# EAGLE schematic Baseboard (EAGLE 6.5.0)
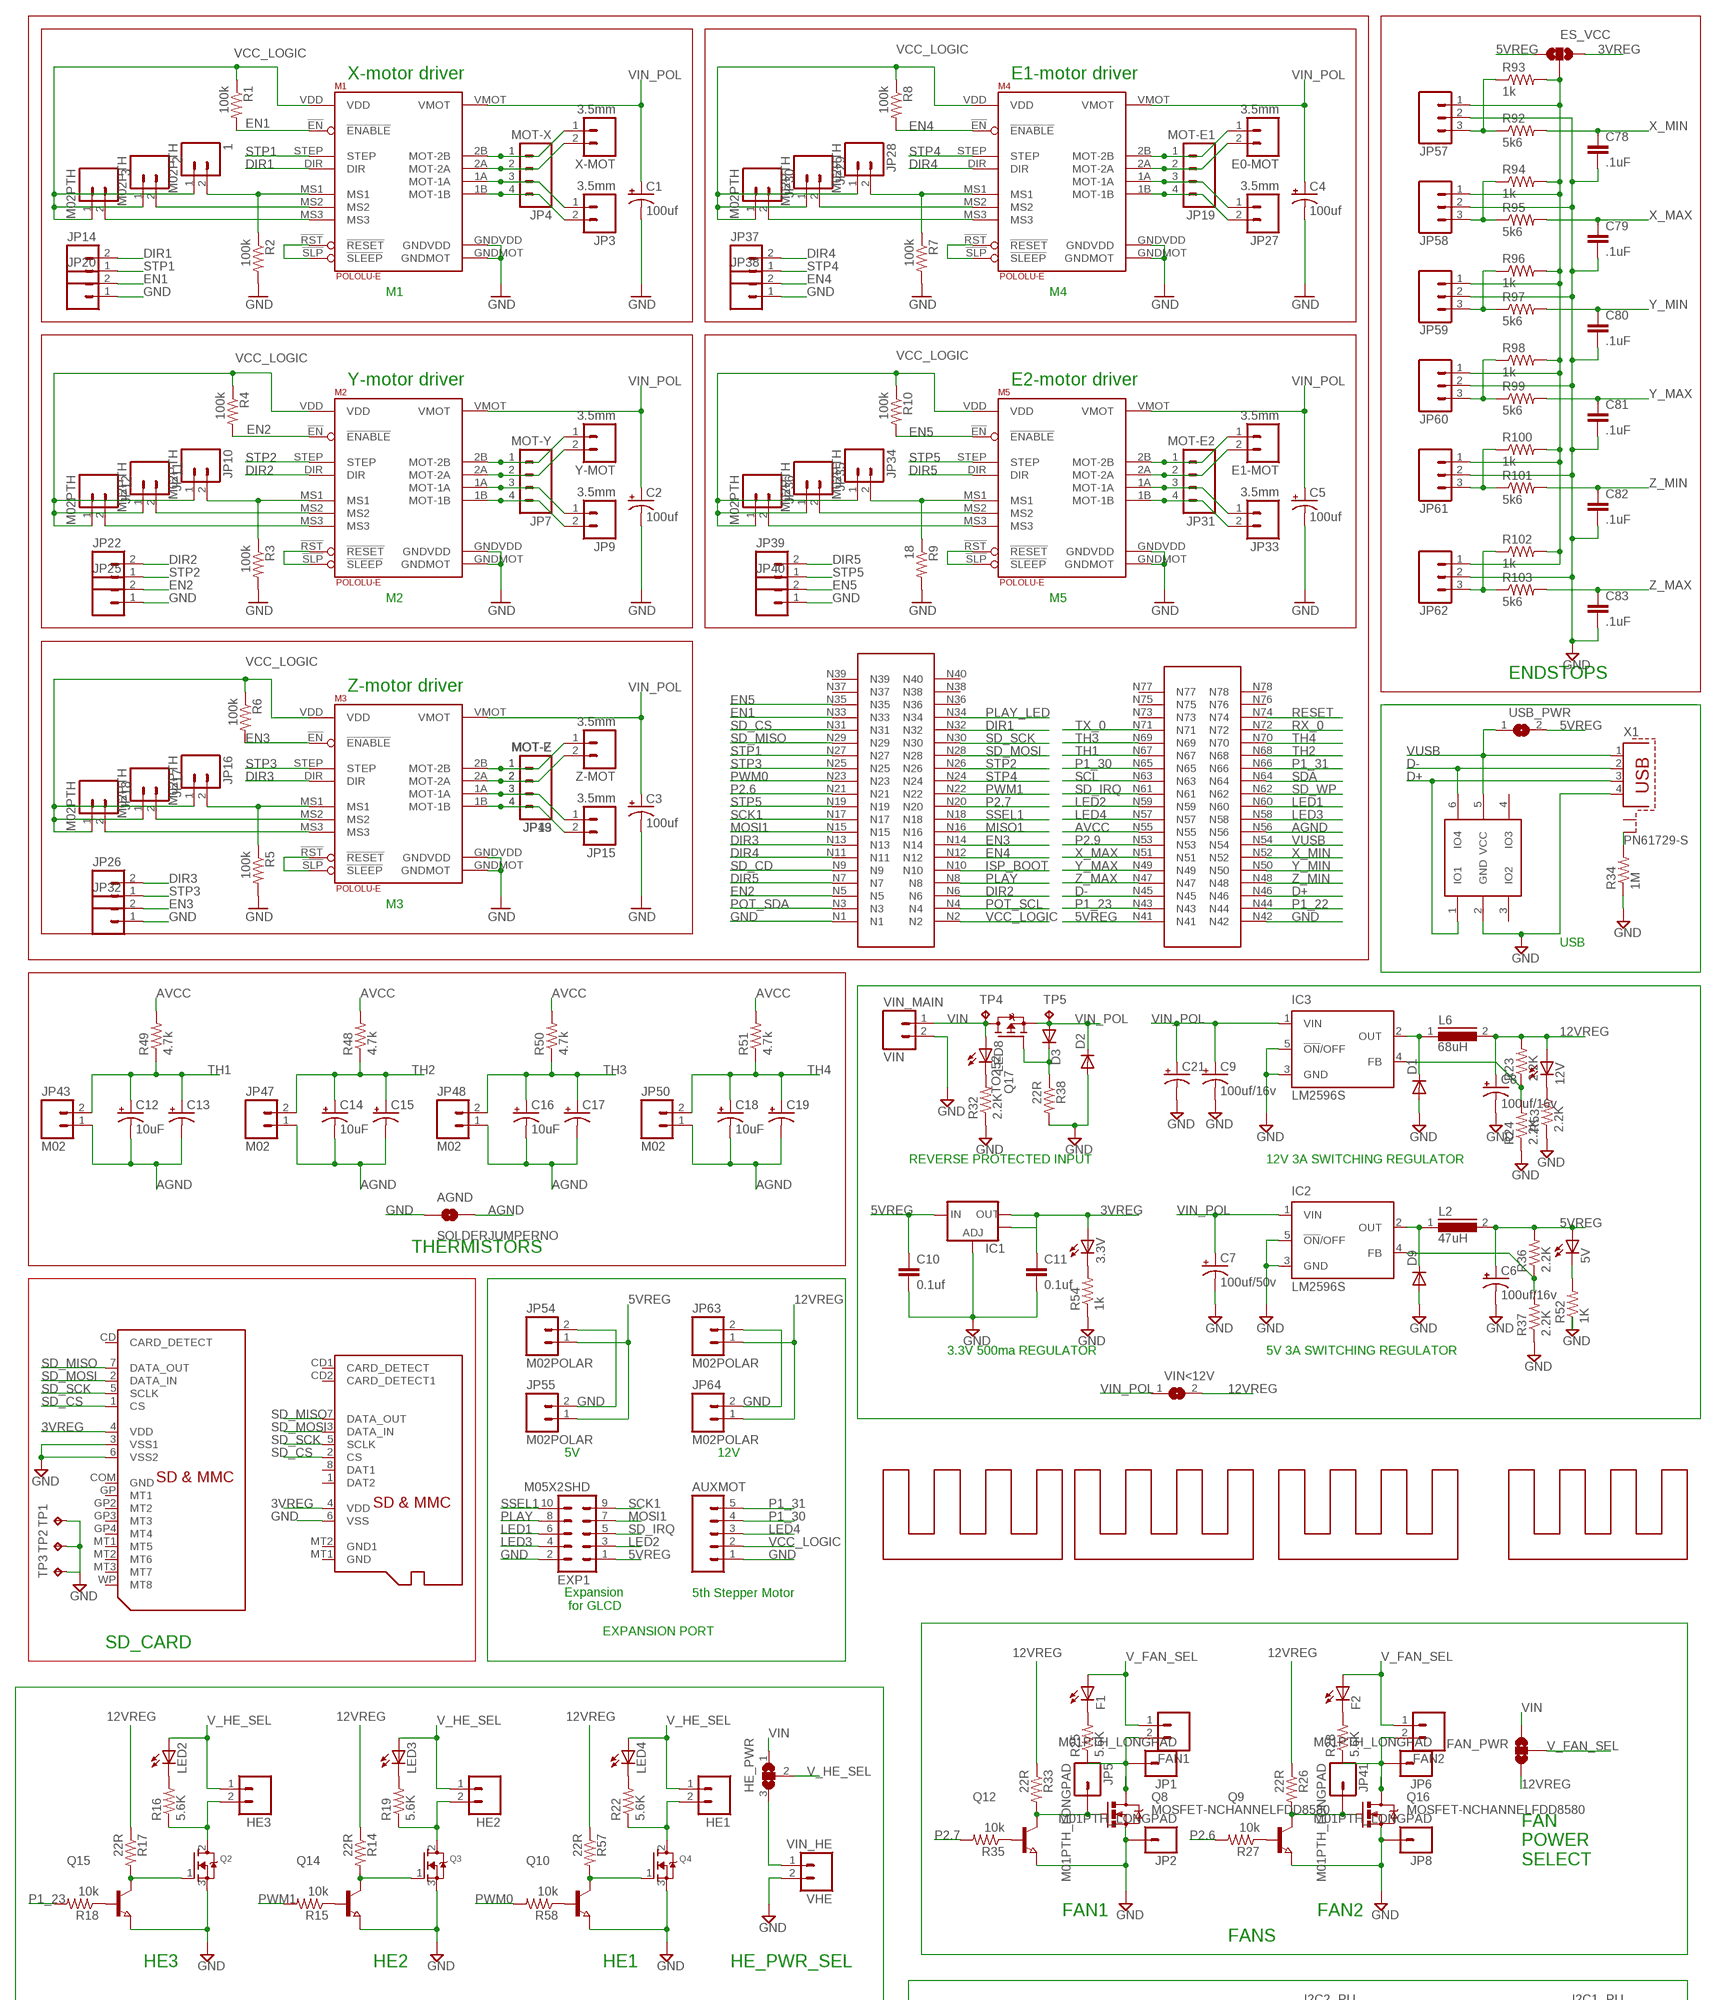
[diagram p0: schematic, sheet 1, part 1 of 2]
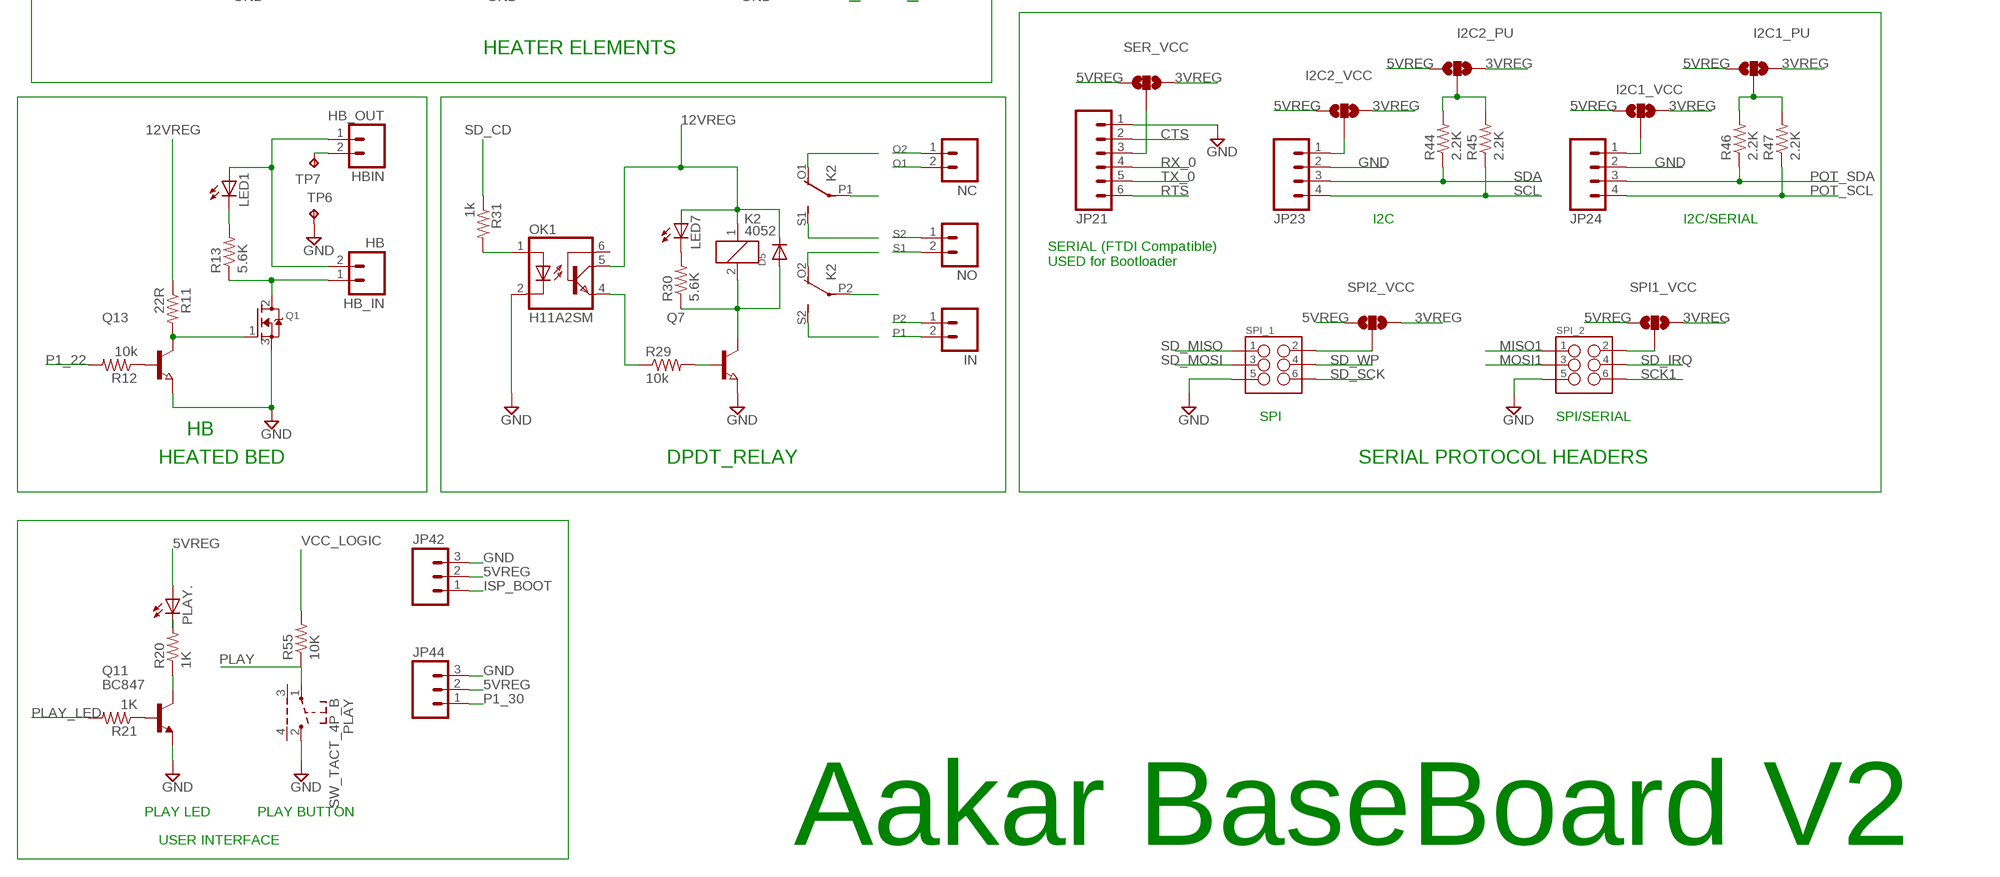
[diagram p1: schematic, sheet 1, part 2 of 2]

## Parts
1  M02PTH  [1X02]
2  M02PTH  [1X02]
3  M02PTH  [1X02]
3.3V  LEDCHIP-LED0603  [CHIP-LED0603]
5V  LEDCHIP-LED0603  [CHIP-LED0603]
12V  LEDCHIP-LED0603  [CHIP-LED0603]
AGND  SOLDERJUMPERNO  [SJ_2S-NO]
AUXMOT  M05PTH_LONGPADS  [1X05_LONGPADS]
C1  100uf  CAP_POLPTH1  [CPOL-RADIAL-100UF-25V]
C2  100uf  CAP_POLPTH1  [CPOL-RADIAL-100UF-25V]
C3  100uf  CAP_POLPTH1  [CPOL-RADIAL-100UF-25V]
C4  100uf  CAP_POLPTH1  [CPOL-RADIAL-100UF-25V]
C5  100uf  CAP_POLPTH1  [CPOL-RADIAL-100UF-25V]
C6  100uf/16v  CPOL-USE3.5-8  [E3,5-8]
C7  100uf/50v  CPOL-USE5-10.5  [E5-10,5]
C8  100uf/16v  CPOL-USE3.5-8  [E3,5-8]
C9  100uf/16v  CPOL-USE3.5-8  [E3,5-8]
C10  0.1uf  CAP0805  [0805]
C11  0.1uf  CAP0805  [0805]
C12  10uF  10UF-TANT  [EIA3216]
C13  CAP_POLPTH2  [CPOL-RADIAL-10UF-25V]
C14  10uF  10UF-TANT  [EIA3216]
C15  CAP_POLPTH2  [CPOL-RADIAL-10UF-25V]
C16  10uF  10UF-TANT  [EIA3216]
C17  CAP_POLPTH2  [CPOL-RADIAL-10UF-25V]
C18  10uF  10UF-TANT  [EIA3216]
C19  CAP_POLPTH2  [CPOL-RADIAL-10UF-25V]
C21  CPOL-USE2.5-7  [E2,5-7]
C78  .1uF  CAP0805  [0805]
C79  .1uF  CAP0805  [0805]
C80  .1uF  CAP0805  [0805]
C81  .1uF  CAP0805  [0805]
C82  .1uF  CAP0805  [0805]
C83  .1uF  CAP0805  [0805]
D1  DIODE-SMC  [SMC]
D2  DIODE-GF1  [GF1]
D3  DIODE-GF1  [GF1]
D5  DIODESMA  [SMADIODE]
D9  DIODE-SMC  [SMC]
E0-MOT  3.5mm  M023.5MM_LOCK  [SCREWTERMINAL-3.5MM-2_LOCK]
E1-MOT  3.5mm  M023.5MM_LOCK  [SCREWTERMINAL-3.5MM-2_LOCK]
ES_VCC  SOLDERJUMPER_2WAYS  [SJ_3]
EXP1  M05X2SHD  [2X5-SHROUDED]
F1  LEDCHIP-LED0603  [CHIP-LED0603]
F2  LEDCHIP-LED0603  [CHIP-LED0603]
FAN1  M025MM  [SCREWTERMINAL-5MM-2]
FAN2  M025MM  [SCREWTERMINAL-5MM-2]
FAN_PWR  SOLDERJUMPER_2WAYT  [SJ_2]
HB  HB_IN  M025MM  [SCREWTERMINAL-5MM-2]
HBIN  HB_OUT  M025MM  [SCREWTERMINAL-5MM-2]
HE1  M025MM  [SCREWTERMINAL-5MM-2]
HE2  M025MM  [SCREWTERMINAL-5MM-2]
HE3  M025MM  [SCREWTERMINAL-5MM-2]
HE_PWR  SJ2WW  [SJ_2W]
I2C1_PU  SOLDERJUMPER_2WAYPASTE1&2  [SJ_3_PASTE1&2]
I2C1_VCC  SOLDERJUMPER_2WAYPASTE1&2  [SJ_3_PASTE1&2]
I2C2_PU  SOLDERJUMPER_2WAYPASTE1&2  [SJ_3_PASTE1&2]
I2C2_VCC  SOLDERJUMPER_2WAYPASTE1&2  [SJ_3_PASTE1&2]
IC1  V_REG_LM1117SOT223  [SOT223]
IC2  LM2596S  [TO263-5]
IC3  LM2596S  [TO263-5]
IN  M025MM  [SCREWTERMINAL-5MM-2]
JP1  M01PTH_LONGPAD  [1X01_LONGPAD]
JP2  M01PTH_LONGPAD  [1X01_LONGPAD]
JP3  3.5mm  M023.5MM_LOCK  [SCREWTERMINAL-3.5MM-2_LOCK]
JP4  MOT-X  M04POLAR  [MOLEX-1X4]
JP5  M01PTH_LONGPAD  [1X01_LONGPAD]
JP6  M01PTH_LONGPAD  [1X01_LONGPAD]
JP7  MOT-Y  M04POLAR  [MOLEX-1X4]
JP8  M01PTH_LONGPAD  [1X01_LONGPAD]
JP9  3.5mm  M023.5MM_LOCK  [SCREWTERMINAL-3.5MM-2_LOCK]
JP10  M02PTH  [1X02]
JP11  M02PTH  [1X02]
JP12  M02PTH  [1X02]
JP13  MOT-E  M04POLAR  [MOLEX-1X4]
JP14  M02POGO_PIN_HOLES_ONLY  [1X02_PP_HOLES_ONLY]
JP15  3.5mm  M023.5MM_LOCK  [SCREWTERMINAL-3.5MM-2_LOCK]
JP16  M02PTH  [1X02]
JP17  M02PTH  [1X02]
JP18  M02PTH  [1X02]
JP19  MOT-E1  M04POLAR  [MOLEX-1X4]
JP20  M02POGO_PIN_HOLES_ONLY  [1X02_PP_HOLES_ONLY]
JP21  M06POLAR  [MOLEX-1X6]
JP22  M02POGO_PIN_HOLES_ONLY  [1X02_PP_HOLES_ONLY]
JP23  M04POLAR  [MOLEX-1X4]
JP24  M04POLAR  [MOLEX-1X4]
JP25  M02POGO_PIN_HOLES_ONLY  [1X02_PP_HOLES_ONLY]
JP26  M02POGO_PIN_HOLES_ONLY  [1X02_PP_HOLES_ONLY]
JP27  3.5mm  M023.5MM_LOCK  [SCREWTERMINAL-3.5MM-2_LOCK]
JP28  M02PTH  [1X02]
JP29  M02PTH  [1X02]
JP30  M02PTH  [1X02]
JP31  MOT-E2  M04POLAR  [MOLEX-1X4]
JP32  M02POGO_PIN_HOLES_ONLY  [1X02_PP_HOLES_ONLY]
JP33  3.5mm  M023.5MM_LOCK  [SCREWTERMINAL-3.5MM-2_LOCK]
JP34  M02PTH  [1X02]
JP35  M02PTH  [1X02]
JP36  M02PTH  [1X02]
JP37  M02POGO_PIN_HOLES_ONLY  [1X02_PP_HOLES_ONLY]
JP38  M02POGO_PIN_HOLES_ONLY  [1X02_PP_HOLES_ONLY]
JP39  M02POGO_PIN_HOLES_ONLY  [1X02_PP_HOLES_ONLY]
JP40  M02POGO_PIN_HOLES_ONLY  [1X02_PP_HOLES_ONLY]
JP41  M01PTH_LONGPAD  [1X01_LONGPAD]
JP42  M03POLAR  [MOLEX-1X3]
JP43  M02  M02POLAR_LOCK  [MOLEX-1X2_LOCK]
JP44  M03POLAR  [MOLEX-1X3]
JP47  M02  M02POLAR_LOCK  [MOLEX-1X2_LOCK]
JP48  M02  M02POLAR_LOCK  [MOLEX-1X2_LOCK]
JP49  MOT-Z  M04POLAR  [MOLEX-1X4]
JP50  M02  M02POLAR_LOCK  [MOLEX-1X2_LOCK]
JP54  M02POLAR  [MOLEX-1X2]
JP55  M02POLAR  [MOLEX-1X2]
JP57  M03POLAR  [MOLEX-1X3]
JP58  M03POLAR  [MOLEX-1X3]
JP59  M03POLAR  [MOLEX-1X3]
JP60  M03POLAR  [MOLEX-1X3]
JP61  M03POLAR  [MOLEX-1X3]
JP62  M03POLAR  [MOLEX-1X3]
JP63  M02POLAR  [MOLEX-1X2]
JP64  M02POLAR  [MOLEX-1X2]
K2  4052  [F4052]
L2  47uH  A26GFC  [A26GFC]
L6  68uH  A26GFC  [A26GFC]
LED1  LEDCHIP-LED0603  [CHIP-LED0603]
LED2  LEDCHIP-LED0603  [CHIP-LED0603]
LED3  LEDCHIP-LED0603  [CHIP-LED0603]
LED4  LEDCHIP-LED0603  [CHIP-LED0603]
LED7  LEDCHIP-LED0603  [CHIP-LED0603]
LED8  LEDCHIP-LED0603  [CHIP-LED0603]
M1  POLOLU-E  POLOLU-ALLEGRO  [POLOLU-ALLEGRO-PTH]
M2  POLOLU-E  POLOLU-ALLEGRO  [POLOLU-ALLEGRO-PTH]
M3  POLOLU-E  POLOLU-ALLEGRO  [POLOLU-ALLEGRO-PTH]
M4  POLOLU-E  POLOLU-ALLEGRO  [POLOLU-ALLEGRO-PTH]
M5  POLOLU-E  POLOLU-ALLEGRO  [POLOLU-ALLEGRO-PTH]
NC  M025MM  [SCREWTERMINAL-5MM-2]
NO  M025MM  [SCREWTERMINAL-5MM-2]
OK1  H11A2SM  [DIL6-SMD]
PLAY  SW_TACT_4P_B  [SW_TACT_STANDARD_RIGHT_ANGLE]
PLAY.  LED5MM  [LED5MM]
Q1  MOSFET-NGDS_TO220V  [TO220V]
Q2  MOSFET-NGDS_TO220V  [TO220V]
Q3  MOSFET-NGDS_TO220V  [TO220V]
Q4  MOSFET-NGDS_TO220V  [TO220V]
Q7  NPN-TRANSISTOR_SOT23  [SOT23]
Q8  MOSFET-NCHANNELFDD8580  [DPAK]
Q9  NPN-TRANSISTOR_SOT23  [SOT23]
Q10  NPN-TRANSISTOR_SOT23  [SOT23]
Q11  BC847  BC847ALT1SMD  [SOT23]
Q12  NPN-TRANSISTOR_SOT23  [SOT23]
Q13  NPN-TRANSISTOR_SOT23  [SOT23]
Q14  NPN-TRANSISTOR_SOT23  [SOT23]
Q15  NPN-TRANSISTOR_SOT23  [SOT23]
Q16  MOSFET-NCHANNELFDD8580  [DPAK]
Q17  TO252  SPD30P06PTO252  [TO252]
R1  100k  RESISTOR0603-RES  [0603-RES]
R2  100k  RESISTOR0603-RES  [0603-RES]
R3  100k  RESISTOR0603-RES  [0603-RES]
R4  100k  RESISTOR0603-RES  [0603-RES]
R5  100k  RESISTOR0603-RES  [0603-RES]
R6  100k  RESISTOR0603-RES  [0603-RES]
R7  100k  RESISTOR0603-RES  [0603-RES]
R8  100k  RESISTOR0603-RES  [0603-RES]
R9  18  RESISTOR0603-RES  [0603-RES]
R10  100k  RESISTOR0603-RES  [0603-RES]
R11  22R  RESISTOR0603-RES  [0603-RES]
R12  10k  RESISTOR0603-RES  [0603-RES]
R13  5.6K  RESISTOR0603-RES  [0603-RES]
R14  22R  RESISTOR0603-RES  [0603-RES]
R15  10k  RESISTOR0603-RES  [0603-RES]
R16  5.6K  RESISTOR0603-RES  [0603-RES]
R17  22R  RESISTOR0603-RES  [0603-RES]
R18  10k  RESISTOR0603-RES  [0603-RES]
R19  5.6K  RESISTOR0603-RES  [0603-RES]
R20  1K  RESISTOR0603-RES  [0603-RES]
R21  1K  1KOHM1/10W1%(0603)  [0603-RES]
R22  5.6K  RESISTOR0603-RES  [0603-RES]
R23  2.2K  RESISTOR0603-RES  [0603-RES]
R24  2.2K  RESISTOR0603-RES  [0603-RES]
R25  5.6K  RESISTOR0603-RES  [0603-RES]
R26  22R  RESISTOR0603-RES  [0603-RES]
R27  10k  RESISTOR0603-RES  [0603-RES]
R28  5.6K  RESISTOR0603-RES  [0603-RES]
R29  10k  RESISTOR0603-RES  [0603-RES]
R30  5.6K  RESISTOR0603-RES  [0603-RES]
R31  1k  RESISTOR0603-RES  [0603-RES]
R32  2.2K  RESISTOR0603-RES  [0603-RES]
R33  22R  RESISTOR0603-RES  [0603-RES]
R34  1M  RESISTOR0805-RES  [0805]
R35  10k  RESISTOR0603-RES  [0603-RES]
R36  2.2K  RESISTOR0603-RES  [0603-RES]
R37  2.2K  RESISTOR0603-RES  [0603-RES]
R38  22R  RESISTOR0603-RES  [0603-RES]
R44  2.2K  RESISTOR0603-RES  [0603-RES]
R45  2.2K  RESISTOR0603-RES  [0603-RES]
R46  2.2K  RESISTOR0603-RES  [0603-RES]
R47  2.2K  RESISTOR0603-RES  [0603-RES]
R48  4.7k  RESISTOR0603-RES  [0603-RES]
R49  4.7k  RESISTOR0603-RES  [0603-RES]
R50  4.7k  RESISTOR0603-RES  [0603-RES]
R51  4.7k  RESISTOR0603-RES  [0603-RES]
R52  1K  RESISTOR0603-RES  [0603-RES]
R53  2.2K  RESISTOR0603-RES  [0603-RES]
R54  1k  RESISTOR0603-RES  [0603-RES]
R55  10K  RESISTOR0603-RES  [0603-RES]
R57  22R  RESISTOR0603-RES  [0603-RES]
R58  10k  RESISTOR0603-RES  [0603-RES]
R92  5k6  RESISTOR0603-RES  [0603-RES]
R93  1k  RESISTOR0603-RES  [0603-RES]
R94  1k  RESISTOR0603-RES  [0603-RES]
R95  5k6  RESISTOR0603-RES  [0603-RES]
R96  1k  RESISTOR0603-RES  [0603-RES]
R97  5k6  RESISTOR0603-RES  [0603-RES]
R98  1k  RESISTOR0603-RES  [0603-RES]
R99  5k6  RESISTOR0603-RES  [0603-RES]
R100  1k  RESISTOR0603-RES  [0603-RES]
R101  5k6  RESISTOR0603-RES  [0603-RES]
R102  1k  RESISTOR0603-RES  [0603-RES]
R103  5k6  RESISTOR0603-RES  [0603-RES]
SER_VCC  SOLDERJUMPER_2WAYPASTE1&2  [SJ_3_PASTE1&2]
SPI1_VCC  SOLDERJUMPER_2WAYPASTE1&2  [SJ_3_PASTE1&2]
SPI2_VCC  SOLDERJUMPER_2WAYPASTE1&2  [SJ_3_PASTE1&2]
SPI_1  M03X2NO_SILK  [2X3-NS]
SPI_2  M03X2NO_SILK  [2X3-NS]
TP1  TPTP15SQ  [TP15SQ]
TP2  TPTP15SQ  [TP15SQ]
TP3  TPTP15SQ  [TP15SQ]
TP4  TPPAD1-13  [P1-13]
TP5  TPPAD1-13  [P1-13]
TP6  TPPAD1-17Y  [P1-17Y]
TP7  TPPAD1-17Y  [P1-17Y]
U$1  HEATSINK  [HEAT_TO]
U$2  MICROSD  [MICROSD]
U$4  CPU_HEADER  [CPU_BOARD]
U$8  HEATSINK  [HEAT_TO]
U$9  ESD  ESD_TPD4E001  [SOT23-6]
U$10  HEATSINK  [HEAT_TO]
U$11  SD_MMC  [SD_MMC]
U$12  HEATSINK  [HEAT_TO]
USB_PWR  SJ  [SJ]
VHE  VIN_HE  M025MM  [SCREWTERMINAL-5MM-2]
VIN  VIN_MAIN  M025MM  [SCREWTERMINAL-5MM-2]
VIN<12V  SJ  [SJ]
X1  PN61729-S  [PN61729-S]
X-MOT  3.5mm  M023.5MM_LOCK  [SCREWTERMINAL-3.5MM-2_LOCK]
Y-MOT  3.5mm  M023.5MM_LOCK  [SCREWTERMINAL-3.5MM-2_LOCK]
Z-MOT  3.5mm  M023.5MM_LOCK  [SCREWTERMINAL-3.5MM-2_LOCK]

## Nets
3VREG: 3.3V.A C11.1 ES_VCC.3 I2C1_PU.3 I2C1_VCC.3 I2C2_PU.3 I2C2_VCC.3 IC1.2(OUT) IC1.4(OUT) SER_VCC.3 SPI1_VCC.3 SPI2_VCC.3 U$2.4(VDD) U$11.4(VDD)
5VREG: 5V.A C6.+ C10.1 ES_VCC.1 EXP1.1 I2C1_PU.1 I2C1_VCC.1 I2C2_PU.1 I2C2_VCC.1 IC1.3(IN) JP42.2 JP44.2 JP54.1 JP55.1 L2.2 PLAY..A R36.2 SER_VCC.1 SPI1_VCC.1 SPI2_VCC.1 U$4.N41 USB_PWR.2
12VREG: 12V.A C8.+ D5.C FAN_PWR.3 JP63.1 JP64.1 K2.1 L6.2 LED7.A OK1.5(COL) R11.1 R14.1 R17.1 R23.2 R26.1 R33.1 R57.1 VIN<12V.2
AGND: AGND.2 C12.C(-) C13.2(-) C14.C(-) C15.2(-) C16.C(-) C17.2(-) C18.C(-) C19.2(-) JP43.1 JP47.1 JP48.1 JP50.1 U$4.N56
AVCC: R48.2 R49.2 R50.2 R51.2 U$4.N55
CTS: JP21.2
D+: U$4.N46 U$9.1(IO1) X1.3
D-: U$4.N45 U$9.6(IO4) X1.2
DIR1: JP14.2 M1.DIR U$4.N32
DIR2: JP22.2 M2.DIR U$4.N6
DIR3: JP26.2 M3.DIR U$4.N13
DIR4: JP37.2 M4.DIR U$4.N11
DIR5: JP39.2 M5.DIR U$4.N7
E-MOT-1A [power]: JP3.1 JP4.3 M1.1A(MOT-1A)
E-MOT-1A1 [power]: JP7.3 JP9.1 M2.1A(MOT-1A)
E-MOT-1A2 [power]: JP13.3 JP15.1 JP49.3 M3.1A(MOT-1A)
E-MOT-1A3 [power]: JP19.3 JP27.1 M4.1A(MOT-1A)
E-MOT-1A4 [power]: JP31.3 JP33.1 M5.1A(MOT-1A)
E-MOT-1B [power]: JP3.2 JP4.4 M1.1B(MOT-1B)
E-MOT-1B1 [power]: JP7.4 JP9.2 M2.1B(MOT-1B)
E-MOT-1B2 [power]: JP13.4 JP15.2 JP49.4 M3.1B(MOT-1B)
E-MOT-1B3 [power]: JP19.4 JP27.2 M4.1B(MOT-1B)
E-MOT-1B4 [power]: JP31.4 JP33.2 M5.1B(MOT-1B)
E-MOT-2A [power]: JP4.2 M1.2A(MOT-2A) X-MOT.2
E-MOT-2A1 [power]: JP7.2 M2.2A(MOT-2A) Y-MOT.2
E-MOT-2A2 [power]: JP13.2 JP49.2 M3.2A(MOT-2A) Z-MOT.2
E-MOT-2A3 [power]: E0-MOT.2 JP19.2 M4.2A(MOT-2A)
E-MOT-2A4 [power]: E1-MOT.2 JP31.2 M5.2A(MOT-2A)
E-MOT-2B [power]: JP4.1 M1.2B(MOT-2B) X-MOT.1
E-MOT-2B1 [power]: JP7.1 M2.2B(MOT-2B) Y-MOT.1
E-MOT-2B2 [power]: JP13.1 JP49.1 M3.2B(MOT-2B) Z-MOT.1
E-MOT-2B3 [power]: E0-MOT.1 JP19.1 M4.2B(MOT-2B)
E-MOT-2B4 [power]: E1-MOT.1 JP31.1 M5.2B(MOT-2B)
E-RESETSLEEP: M1.!RST(!RESET) M1.!SLP(!SLEEP)
E-RESETSLEEP1: M2.!RST(!RESET) M2.!SLP(!SLEEP)
E-RESETSLEEP2: M3.!RST(!RESET) M3.!SLP(!SLEEP)
E-RESETSLEEP3: M4.!RST(!RESET) M4.!SLP(!SLEEP)
E-RESETSLEEP4: M5.!RST(!RESET) M5.!SLP(!SLEEP)
EN1: JP20.2 M1.!EN(!ENABLE) R1.2 U$4.N33
EN2: JP25.2 M2.!EN(!ENABLE) R4.2 U$4.N5
EN3: JP32.2 M3.!EN(!ENABLE) R6.2 U$4.N14
EN4: JP38.2 M4.!EN(!ENABLE) R8.2 U$4.N12
EN5: JP40.2 M5.!EN(!ENABLE) R10.2 U$4.N35
GND [power]: AGND.1 AUXMOT.1 C1.2(-) C2.2(-) C3.2(-) C4.2(-) C5.2(-) C6.- C7.- C8.- C9.- C10.2 C11.2 C21.- C78.2 C79.2 C80.2 C81.2 C82.2 C83.2 D1.A D2.A D9.A EXP1.2 IC1.1(ADJ) IC2.3(GND) IC2.5(!ON!/OFF) IC3.3(GND) IC3.5(!ON!/OFF) JP2.1 JP8.1 JP20.1 JP21.1 JP23.2 JP24.2 JP25.1 JP32.1 JP38.1 JP40.1 JP42.3 JP44.3 JP54.2 JP55.2 JP57.2 JP58.2 JP59.2 JP60.2 JP61.2 JP62.2 JP63.2 JP64.2 M1.GNDMOT M1.GNDVDD M2.GNDMOT M2.GNDVDD M3.GNDMOT M3.GNDVDD M4.GNDMOT M4.GNDVDD M5.GNDMOT M5.GNDVDD OK1.2(C) PLAY.2 Q1.3(S) Q2.3(S) Q3.3(S) Q4.3(S) Q7.2(E) Q8.3(S) Q9.2(E) Q10.2(E) Q11.2(E) Q12.2(E) Q13.2(E) Q14.2(E) Q15.2(E) Q16.3(S) R2.2 R3.2 R5.2 R7.2 R9.2 R24.1 R32.1 R34.1 R37.1 R38.2 R52.1 R53.1 R54.1 SPI_1.5 SPI_2.5 TP1.TP TP2.TP TP3.TP TP6.TP U$2.6(VSS) U$4.N1 U$4.N42 U$9.2(GND) U$11.3(VSS1) U$11.6(VSS2) VHE.2 VIN.2 X1.4
ISP_BOOT: JP42.1 U$4.N10
LED1: EXP1.6 U$4.N60
LED2: EXP1.3 U$4.N59
LED3: EXP1.4 U$4.N58
LED4: AUXMOT.3 U$4.N57
MISO1: SPI_2.1 U$4.N16
MOSI1: EXP1.7 SPI_2.3 U$4.N15
N$1: JP11.2 M2.MS2
N$2: JP10.2 M2.MS1 R3.1
N$3: JP12.2 M2.MS3
N$4: JP17.2 M3.MS2
N$5: JP16.2 M3.MS1 R5.1
N$6: JP18.2 M3.MS3
N$7: JP29.2 M4.MS2
N$8: JP28.2 M4.MS1 R7.1
N$9: JP30.2 M4.MS3
N$10: JP35.2 M5.MS2
N$11: JP34.2 M5.MS1 R9.1
N$12: JP36.2 M5.MS3
N$13: D1.C IC3.2(OUT) L6.1
N$14: D9.C IC2.2(OUT) L2.1
N$15: HB.1 Q1.2(D) R13.1
N$16: HBIN.2 TP7.TP
N$17: HB.2 HBIN.1 LED1.A
N$18: Q1.1(G) Q13.3(C) R11.2
N$20: LED1.C R13.2
N$21: 2.2 M1.MS2
N$22: 1.2 M1.MS1 R2.1
N$23: 3.2 M1.MS3
N$24: SPI1_VCC.2 SPI_2.2
N$25: LED2.C R16.2
N$26: SPI2_VCC.2 SPI_1.2
N$27: Q3.1(G) Q14.3(C) R14.2
N$28: HE3.2 Q2.2(D) R16.1
N$29: F1.C R25.2
N$30: LED3.C R19.2
N$31: Q14.1(B) R15.1
N$32: HE2.2 Q3.2(D) R19.1
N$33: Q13.1(B) R12.1
N$34: LED4.C R22.2
N$35: Q11.1(B) R21.1
N$36: HE1.2 Q4.2(D) R22.1
N$37: 5V.C R52.2
N$38: Q2.1(G) Q15.3(C) R17.2
N$40: FAN1.2 JP1.1 Q8.4(D) R25.1
N$41: 12V.C R53.2
N$42: F2.C R28.2
N$43: JP41.1 Q9.3(C) Q16.1(G) R26.2
N$44: FAN2.2 JP6.1 Q16.4(D) R28.1
N$45: 3.3V.C R54.2
N$48: OK1.1(A) R31.2
N$49: OK1.4(EMI) R29.1
N$50: Q7.1(B) R29.2
N$51: Q15.1(B) R18.1
N$52: LED7.C R30.2
N$53: D5.A K2.2 Q7.3(C) R30.1
N$57: LED8.C R32.2
N$58: JP5.1 Q8.1(G) Q12.3(C) R33.2
N$60: IC2.4(FB) R36.1 R37.2
N$61: JP21.3 SER_VCC.2
N$63: R34.2 X1.S2
N$68: PLAY..K(C) R20.2
N$69: Q12.1(B) R35.1
N$71: I2C2_VCC.2 JP23.1
N$72: I2C2_PU.2 R44.2 R45.2
N$73: I2C1_VCC.2 JP24.1
N$74: I2C1_PU.2 R46.2 R47.2
N$84: D3.C Q17.1(G) R38.1
N$91: JP61.3 R100.1 R101.1
N$92: JP59.3 R96.1 R97.1
N$93: JP62.3 R102.1 R103.1
N$97: Q9.1(B) R27.1
N$98: Q4.1(G) Q10.3(C) R57.2
N$99: Q10.1(B) R58.1
N$100: IC3.4(FB) R23.1 R24.2
N$114: JP58.3 R94.1 R95.1
N$115: ES_VCC.2 JP57.1 JP58.1 JP59.1 JP60.1 JP61.1 JP62.1 R93.2 R94.2 R96.2 R98.2 R100.2 R102.2
N$117: JP60.3 R98.1 R99.1
N$122: JP57.3 R92.1 R93.1
O1: K2.O1(2:O) NC.2
O2: K2.O2(3:O) NC.1
P1: IN.2 K2.P1(2:P)
P1_22: R12.2 U$4.N44
P1_23: R18.2 U$4.N43
P1_30: AUXMOT.4 JP44.1 U$4.N65
P1_31: AUXMOT.5 U$4.N66
P2: IN.1 K2.P2(3:P)
P2.6: R27.2 U$4.N21
P2.7: R35.2 U$4.N20
P2.9: U$4.N53
PL#: Q11.3(C) R20.1
PLAY: EXP1.8 PLAY.1 R55.1 U$4.N8
PLAY_LED: R21.2 U$4.N34
POT_SCL: JP24.4 R47.1 U$4.N4
POT_SDA: JP24.3 R46.1 U$4.N3
PWM0: R58.2 U$4.N23
PWM1: R15.2 U$4.N22
RESET: U$4.N74
RTS: JP21.6
RX_0: JP21.4 U$4.N72
S1: K2.S1(2:S) NO.2
S2: K2.S2(3:S) NO.1
SCK1: EXP1.9 SPI_2.6 U$4.N17
SCL: JP23.4 R45.1 U$4.N63
SD_CD: R31.1 U$4.N9
SD_CS: U$2.2(CS) U$4.N31 U$11.1(CS)
SD_IRQ: EXP1.5 SPI_2.4 U$4.N61
SD_MISO: SPI_1.1 U$2.7(DATA_OUT) U$4.N29 U$11.7(DATA_OUT)
SD_MOSI: SPI_1.3 U$2.3(DATA_IN) U$4.N28 U$11.2(DATA_IN)
SD_SCK: SPI_1.6 U$2.5(SCLK) U$4.N30 U$11.5(SCLK)
SD_WP: SPI_1.4 U$4.N62
SDA: JP23.3 R44.1 U$4.N64
SSEL1: EXP1.10 U$4.N18
STP1: JP14.1 M1.STEP U$4.N27
STP2: JP22.1 M2.STEP U$4.N26
STP3: JP26.1 M3.STEP U$4.N25
STP4: JP37.1 M4.STEP U$4.N24
STP5: JP39.1 M5.STEP U$4.N19
TH1: C12.A(+) C13.1(+) JP43.2 R49.1 U$4.N67
TH2: C14.A(+) C15.1(+) JP47.2 R48.1 U$4.N68
TH3: C16.A(+) C17.1(+) JP48.2 R50.1 U$4.N69
TH4: C18.A(+) C19.1(+) JP50.2 R51.1 U$4.N70
TX_0: JP21.5 U$4.N71
V_FAN_SEL: F1.A F2.A FAN1.1 FAN2.1 FAN_PWR.2
V_HE_SEL: HE1.1 HE2.1 HE3.1 HE_PWR.2 LED2.A LED3.A LED4.A
VCC_LOGIC: 1.1 2.1 3.1 AUXMOT.2 JP10.1 JP11.1 JP12.1 JP16.1 JP17.1 JP18.1 JP28.1 JP29.1 JP30.1 JP34.1 JP35.1 JP36.1 M1.VDD M2.VDD M3.VDD M4.VDD M5.VDD R1.1 R4.1 R6.1 R8.1 R10.1 R55.2 U$4.N2
VIN: FAN_PWR.1 HE_PWR.1 LED8.A Q17.3(D) TP4.TP VIN.1
VIN_HE: HE_PWR.3 VHE.1
VIN_POL: C1.1(+) C2.1(+) C3.1(+) C4.1(+) C5.1(+) C7.+ C9.+ C21.+ D2.C D3.A IC2.1(VIN) IC3.1(VIN) M1.VMOT M2.VMOT M3.VMOT M4.VMOT M5.VMOT Q17.2(S) TP5.TP VIN<12V.1
VUSB: U$4.N54 U$9.5(VCC) USB_PWR.1 X1.1
X_MAX: C79.1 R95.2 U$4.N51
X_MIN: C78.1 R92.2 U$4.N52
Y_MAX: C81.1 R99.2 U$4.N49
Y_MIN: C80.1 R97.2 U$4.N50
Z_MAX: C83.1 R103.2 U$4.N47
Z_MIN: C82.1 R101.2 U$4.N48
Unconnected: OK1.6(BAS) PLAY.3 PLAY.4 U$2.1(DAT2) U$2.8(DAT1) U$2.CD1(CARD_DETECT) U$2.CD2(CARD_DETECT1) U$2.MT1(GND) U$2.MT2(GND1) U$4.N36 U$4.N37 U$4.N38 U$4.N39 U$4.N40 U$4.N73 U$4.N75 U$4.N76 U$4.N77 U$4.N78 U$9.3(IO2) U$9.4(IO3) U$11.CD(CARD_DETECT) U$11.COM(GND) U$11.GP2(MT2) U$11.GP3(MT3) U$11.GP4(MT4) U$11.GP(MT1) U$11.MT1(MT5) U$11.MT2(MT6) U$11.MT3(MT7) U$11.WP(MT8) X1.S1

## Notes on the sheet
- X-motor driver | E1-motor driver
- M1 | M4
- Y-motor driver | E2-motor driver
- M2 | M5
- ENDSTOPS
- Z-motor driver
- M3
- USB
- REVERSE PROTECTED INPUT | 12V 3A SWITCHING REGULATOR
- THERMISTORS
- 3.3V 500ma REGULATOR | 5V 3A SWITCHING REGULATOR
- 5V | 12V
- 5th Stepper Motor
- Expansion
   for GLCD
- EXPANSION PORT
- SD_CARD
- FAN
  POWER
  SELECT
- FAN1 | FAN2
- FANS
- HE3 | HE2 | HE1 | HE_PWR_SEL
- HEATER ELEMENTS
- I2C | I2C/SERIAL
- SERIAL (FTDI Compatible)
  USED for Bootloader
- SPI | SPI/SERIAL
- HB
- HEATED BED | DPDT_RELAY | SERIAL PROTOCOL HEADERS
- PLAY LED | PLAY BUTTON
- USER INTERFACE | Aakar BaseBoard V2

## Library data of the parts
1-3 E0-MOT E1-MOT HB HBIN JP3 JP9-JP12 JP15-JP18 JP27-JP30 JP33-JP36 JP43 JP47 JP48 JP50 JP54 JP55 JP63 JP64 X-MOT Y-MOT Z-MOT = SparkFun-Connectors:M02: Standard 2-pin 0.1" header. Use with - straight break away headers ( PRT-00116) - right angle break away headers (PRT-00553) - swiss pins (PRT-00743) - machine pins (PRT-00117) - female headers (PRT-00115) Molex polarized connector foot print use with: PRT-08233 with associated crimp pins and housings. 2.54_SCREWTERM for use with PRT-10571. 3.5mm Screw Terminal footprints for PRT-08084 5mm Screw Terminal footprints for use with PRT-08433
3.3V 5V 12V F1 F2 LED1-LED4 LED7 LED8 = adafruit:LED: LED OSRAM: - CHIPLED LG R971, LG N971, LY N971, LG Q971, LY Q971, LO R971, LY R971 LH N974, LH R974 LS Q976, LO Q976, LY Q976 LO Q996 - Hyper CHIPLED LW Q18S LB Q993, LB Q99A, LB R99A - SideLED LS A670, LO A670, LY A670, LG A670, LP A670 LB A673, LV A673, LT A673, LW A673 LH A674 LY A675 LS A676, LA A676, LO A676, LY A676, LW A676 LS A679, LY A679, LG A679 - Hyper Micro SIDELED® LS Y876, LA Y876, LO Y876, LY Y876 LT Y87S - SmartLED LW L88C, LW L88S LB L89C, LB L89S, LG L890 LS L89K, LO L89K, LY L89K LS L896, LA L896, LO L896, LY L896 - TOPLED LS T670, LO T670, LY T670, LG T670, LP T670 LSG T670, LSP T670, LSY T670, LOP T670, LYG T670 LG T671, LOG T671, LSG T671 LB T673, LV T673, LT T673, LW T673 LH T674 LS T676, LA T676, LO T676, LY T676, LB T676, LH T676, LSB T676, LW T676 LB T67C, LV T67C, LT T67C, LS T67K, LO T67K, LY T67K, LW E67C LS E67B, LA E67B, LO E67B, LY E67B, LB E67C, LV E67C, LT E67C LW T67C LS T679, LY T679, LG T679 LS T770, LO T770, LY T770, LG T770, LP T770 LB T773, LV T773, LT T773, LW T773 LH T774 LS E675, LA E675, LY E675, LS T675 LS T776, LA T776, LO T776, LY T776, LB T776 LHGB T686 LT T68C, LB T68C - Hyper Mini TOPLED® LB M676 - Mini TOPLED Santana® LG M470 LS M47K, LO M47K, LY M47K Source: http://www.osram.convergy.de/
AGND = SparkFun-Passives:SOLDERJUMPER: Solder Jumper Standard SMD solder jumper. Used to automate production. Two varients : Normally Open and Normally Closed are the same, but have different paste layers. NC will have a large amount of paste and should jumper during reflow.
AUXMOT = SparkFun-Connectors:M05: Header 5 Standard 5-pin 0.1" header. Use with straight break away headers (SKU : PRT-00116), right angle break away headers (PRT-00553), swiss pins (PRT-00743), machine pins (PRT-00117), and female headers (PRT-00115). Molex polarized connector foot print use with SKU : PRT-08230 with associated crimp pins and housings.
C1-C5 = SparkFun:CAP_POL: Capacitor Polarized These are standard SMD and PTH capacitors. Normally 10uF, 47uF, and 100uF in electrolytic and tantalum varieties. Always verify the external diameter of the through hole cap, it varies with capacity, voltage, and manufacturer. The EIA devices should be standard.
C6-C9 C21 = adafruit:CPOL-US: POLARIZED CAPACITOR, American symbol
C10 C11 = SparkFun-Passives:CAP: Capacitor Standard 0603 ceramic capacitor, and 0.1" leaded capacitor.
C12 C14 C16 C18 = SparkFun-Capacitors:10UF-TANT: 10uF Tantalum SMT CAP-00811- 16V 10% (EIA-3216); PROD_ID: CAP-00811
C13 C15 C17 C19 = SparkFun-Passives:CAP_POL: Capacitor Polarized These are standard SMD and PTH capacitors. Normally 10uF, 47uF, and 100uF in electrolytic and tantalum varieties. Always verify the external diameter of the through hole cap, it varies with capacity, voltage, and manufacturer. The EIA devices should be standard.
C78-C83 = SparkFun-Capacitors:CAP: Capacitor Standard 0603 ceramic capacitor, and 0.1" leaded capacitor.
D1-D3 D9 = diode:DIODE-: DIODE
D5 = adafruit:DIODE: Diode SMADIODE - SMA Surface Mount Package 20V 1A Schottky Diode Digikey: 641-1014-6-ND DO-1N4148 - Through Hole Small Current Diode SOD-123 20V 1 A (.5mV Vf) Schottky Diode - Digikey: MBRX120TPMSCT-ND SOD-323 10V 570mA (.38mV Vf, 3ns) Schottky Diode - Digikey: ZLLS410CT-ND SOD-523 30V 30mA Schottky Diode (RB751S-40TE61) - Digikey: RB751S-40TE61CT-ND SOT23-R/W - SOT23 Package (R = Solder Paste/Reflow Ovens, W = Hand-Soldering) BAT54Film 40V 300mA - Digikey: 497-7162-1-ND
ES_VCC FAN_PWR = SparkFun:SOLDERJUMPER_2WAY: Solder Jumper 2 way solder jumper
EXP1 = SparkFun:M05X2: Header 5x2 Standard 10-pin dual row 0.1" header. Commonly used with AVR-ISP. Use with Spark Fun Electronics SKU: PRT-00778
FAN1 FAN2 HE1-HE3 IN JP14 JP20 JP22 JP25 JP26 JP32 JP37-JP40 NC NO VHE VIN = SparkFun:M02: Header 2 Standard 2-pin 0.1" header. Use with straight break away headers (SKU : PRT-00116), right angle break away headers (PRT-00553), swiss pins (PRT-00743), machine pins (PRT-00117), and female headers (PRT-00115). Molex polarized connector foot print use with SKU : PRT-08233 with associated crimp pins and housings.
HE_PWR = jumper:SJ2W: SMD solder JUMPER
I2C1_PU I2C1_VCC I2C2_PU I2C2_VCC SER_VCC SPI1_VCC SPI2_VCC = SparkFun-Passives:SOLDERJUMPER_2WAY: Solder Jumper 2 way solder jumper
IC1 = SparkFun-PowerIC:V_REG_LM1117: Voltage Regulator LM1117 Standard adjustable voltage regulator but in SMD form. Spark Fun Electronics SKU : COM-00595
IC2 IC3 = national-semiconductor:LM2596: SIMPLE SWITCHER® Power Converter 150 kHz 3A Step-Down Voltage Regulator Source: http://www.national.com/ds/LM/LM2596.pdf; MF: NATIONAL SEMICONDUCTOR; MPN: LM2596S-ADJ/NOPB; OC_FARNELL: 9494367; OC_NEWARK: 41K3842
JP1 JP2 JP5 JP6 JP8 JP41 = SparkFun:M01: Header 1 Standard 1-pin 0.1" header. Use with straight break away headers (SKU : PRT-00116), right angle break away headers (PRT-00553), swiss pins (PRT-00743), machine pins (PRT-00117), and female headers (PRT-00115).
JP4 JP7 JP13 JP19 JP31 JP49 = SparkFun:M04: Header 4 Standard 4-pin 0.1" header. Use with straight break away headers (SKU : PRT-00116), right angle break away headers (PRT-00553), swiss pins (PRT-00743), machine pins (PRT-00117), and female headers (PRT-00115). Molex polarized connector foot print use with SKU : PRT-08231 with associated crimp pins and housings. 1MM SMD Version SKU: PRT-10208
JP21 = SparkFun-Connectors:M06: Header 6 Standard 6-pin 0.1" header. Use with straight break away headers (SKU : PRT-00116), right angle break away headers (PRT-00553), swiss pins (PRT-00743), machine pins (PRT-00117), and female headers (PRT-00115). Molex polarized connector foot print use with SKU : PRT-08094 with associated crimp pins and housings. NOTES ON THE VARIANTS LOCK and LOCK_LONGPADS... This footprint was designed to help hold the alignment of a through-hole component (i.e. 6-pin header) while soldering it into place. You may notice that each hole has been shifted either up or down by 0.005 of an inch from it's more standard position (which is a perfectly straight line). This slight alteration caused the pins (the squares in the middle) to touch the edges of the holes. Because they are alternating, it causes a "brace" to hold the component in place. 0.005 has proven to be the perfect amount of "off-center" position when using our standard breakaway headers. Although looks a little odd when you look at the bare footprint, once you have a header in there, the alteration is very hard to notice. Also,if you push a header all the way into place, it is covered up entirely on the bottom side. This idea of altering the position of holes to aid alignment will be further integrated into the Sparkfun Library for other footprints. It can help hold any component with 3 or more connection pins.
JP23 JP24 = SparkFun-Connectors:M04: Header 4 Standard 4-pin 0.1" header. Use with straight break away headers (SKU : PRT-00116), right angle break away headers (PRT-00553), swiss pins (PRT-00743), machine pins (PRT-00117), and female headers (PRT-00115). Molex polarized connector foot print use with SKU : PRT-08231 with associated crimp pins and housings. 1MM SMD Version SKU: PRT-10208
JP42 JP44 JP57-JP62 = SparkFun:M03: Header 3 Standard 3-pin 0.1" header. Use with straight break away headers (SKU : PRT-00116), right angle break away headers (PRT-00553), swiss pins (PRT-00743), machine pins (PRT-00117), and female headers (PRT-00115). Molex polarized connector foot print use with SKU : PRT-08232 with associated crimp pins and housings.
K2 = relay:4052: RELAY 2 x switch, Finder; OC_FARNELL: unknown; OC_NEWARK: unknown
L2 L6 = inductors:A26GFC: INDUCTOR
M1-M5 = pololu-allegro:POLOLU-ALLEGRO
OK1 = optocoupler:H11A*?M: General Purpose 6-Pin Phototransistor Optocouplers Source: http://www.fairchildsemi.com/ds/4N/4N35-M.pdf; OC_FARNELL: unknown; OC_NEWARK: unknown
PLAY = dp_devices:SW_TACT_4P_B
PLAY. = SparkFun-LED:LED: LEDs Standard schematic elements and footprints for 5mm, 3mm, 1206, and 0603 sized LEDs. 5mm - Spark Fun Electronics SKU : COM-00529 (and others)
Q1-Q4 = adafruit:MOSFET-N: N-Channel Mosfet 2N7002E - 60V 260mA SOT23 [Digikey: 2N7002ET1GOSTR-ND] - REEL BSH103 - 30V 850mA SOT23 [Digikey: 568-5013-1-ND]
Q7 Q9 Q10 Q12-Q15 = semicon-smd-ipc:NPN-TRANSISTOR_: NPN TRANSISTOR
Q8 Q16 = SparkFun:MOSFET-NCHANNEL
Q11 = transistor-npn:BC847*: NPN Transistor
Q17 = transistor-fet:SPD30P06P: SIPMOS(R) Power-Transistor P-Channel, Enhancement mode Source: http://www.infineon.com/upload/Document/cmc_upload/documents/012/3615/SPD_U30P06P.pdf
R1-R20 R22-R33 R35-R38 R44-R55 R57 R58 R92-R103 = SparkFun:RESISTOR: Resistor Basic schematic elements and footprints for 0603, 1206, and PTH resistors.
R21 = SparkFun-Resistors:1KOHM1/10W1%(0603): RES-07856; PROD_ID: RES-07856
R34 = SparkFun-Resistors:RESISTOR: Resistor Basic schematic elements and footprints for 0603, 1206, and PTH resistors.
SPI_1 SPI_2 = SparkFun-Connectors:M03X2: 2x3 .1" header. Shrouded, with keying- CONN-10681 SMT- CONN-11415 Pogo pins- HW-11044
TP1-TP7 = testpad:TP: Test pad
U$1 U$8 U$10 U$12 = heat_custom:HEATSINK
U$2 = adafruit:MICROSD: Micro-SD / Transflash card holder with SPI pinout For the 3M # 2908-05WB-MG and/or 4UCON #19656 push-push type
U$4 = custom_parts:CPU_HEADER
U$9 = adafruit:ESD_TPD4E001
U$11 = custom_parts:SD_MMC
USB_PWR VIN<12V = jumper:SJ: SMD solder JUMPER
X1 = con-berg:PN61729-S: BERG USB connector; OC_FARNELL: unknown; OC_NEWARK: unknown